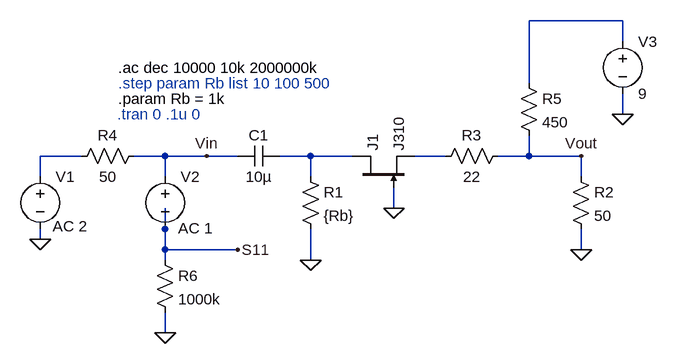
[diagram p0: schematic ece522p3.1.asc]
ece522p3.1.asc, the LTspice schematic file:
Version 4
SHEET 1 1640 696
WIRE 608 -32 464 -32
WIRE 608 0 608 -32
WIRE 464 64 464 -32
WIRE 608 112 608 80
WIRE -224 176 -288 176
WIRE -96 176 -144 176
WIRE -32 176 -96 176
WIRE 16 176 -32 176
WIRE 128 176 80 176
WIRE 192 176 128 176
WIRE 336 176 288 176
WIRE 464 176 464 144
WIRE 464 176 416 176
WIRE 544 176 464 176
WIRE -288 208 -288 176
WIRE -96 208 -96 176
WIRE 128 208 128 176
WIRE 544 208 544 176
WIRE 256 256 256 224
WIRE -96 288 -96 256
WIRE -288 304 -288 288
WIRE -96 320 -96 288
WIRE 16 320 -96 320
WIRE 544 320 544 288
WIRE -96 336 -96 320
WIRE 128 336 128 288
WIRE -96 448 -96 416
FLAG -288 304 0
FLAG -96 448 0
FLAG 128 336 0
FLAG 256 256 0
FLAG 16 320 S11
FLAG -32 176 Vin
FLAG 608 112 0
FLAG 544 320 0
FLAG 544 176 Vout
SYMBOL cap 80 160 R90
WINDOW 0 0 32 VBottom 2
WINDOW 3 32 32 VTop 2
SYMATTR InstName C1
SYMATTR Value 10µ
SYMBOL res 112 192 R0
SYMATTR InstName R1
SYMATTR Value {Rb}
SYMBOL res 432 160 R90
WINDOW 0 0 56 VBottom 2
WINDOW 3 32 56 VTop 2
SYMATTR InstName R3
SYMATTR Value 22
SYMBOL njf 192 224 R270
SYMATTR InstName J1
SYMATTR Value J310
SYMBOL voltage -288 192 R0
WINDOW 3 24 152 Left 2
WINDOW 123 19 92 Left 2
WINDOW 39 0 0 Left 0
SYMATTR InstName V1
SYMATTR Value ""
SYMATTR Value2 AC 2
SYMBOL voltage -96 192 R0
WINDOW 123 20 95 Left 2
WINDOW 39 0 0 Left 0
SYMATTR InstName V2
SYMATTR Value ""
SYMATTR Value2 AC 1
SYMBOL res -128 160 R90
WINDOW 0 0 56 VBottom 2
WINDOW 3 32 56 VTop 2
SYMATTR InstName R4
SYMATTR Value 50
SYMBOL res 448 48 R0
SYMATTR InstName R5
SYMATTR Value 450
SYMBOL res -112 320 R0
SYMATTR InstName R6
SYMATTR Value 1000k
SYMBOL voltage 608 -16 R0
WINDOW 123 0 0 Left 0
WINDOW 39 0 0 Left 0
SYMATTR InstName V3
SYMATTR Value 9
SYMBOL res 528 192 R0
SYMATTR InstName R2
SYMATTR Value 50
TEXT -168 40 Left 2 !.ac dec 10000 10k 2000000k
TEXT -168 64 Left 2 ;.step param Rb list 10 100 500
TEXT -168 88 Left 2 !.param Rb = 1k
TEXT -170 112 Left 2 ;.tran 0 .1u 0

The netlist it stands for:
* ece522p3.1.asc
C1 N003 Vin 10µ
R1 N003 0 {Rb}
R3 Vout N004 22
J1 N003 0 N004 J310
V1 N002 0 AC 2
V2 Vin S11 AC 1
R4 Vin N002 50
R5 N001 Vout 450
R6 S11 0 1000k
V3 N001 0 9
R2 Vout 0 50
.model NJF NJF
.model PJF PJF
.lib standard.jft
.ac dec 10000 10k 2000000k
* .step param Rb list 10 100 500
.param Rb = 1k
* .tran 0 .1u 0
.backanno
.end